# Altium schematic sheet A1-A1 Gain control driver.SchDoc: A1-A1 Gain contol driver
size D; Date: 09-24-10; DrawnBy: C. Lewis; Engineer: C. Lewis; Address1: 4650 NORRIS CANYON RD.; Address2: SAN RAMON, CA 94583; DocumentNumber: 35133; Revision: D; SheetNumber: 5; SheetTotal: 20; PageSetup: Record=PageOptions|CenterHorizontal=True|CenterVertical=True|PrintScale=0.51|XCorrection=1.00|YCorrection=1.00|PrintKind=1|BorderSize=5000000|LeftOffset=0|BottomOffset=0|Orientation=2|PaperLength=1000|PaperWidth=1000|Scale=100|PaperSource=15|PrintQuality=600|MediaType=1|DitherType=10|PaperKind=11x17|PrintScaleMode=1; DocumentName: Sheet1.SCHDOC; ModifiedDate: 10-27-11
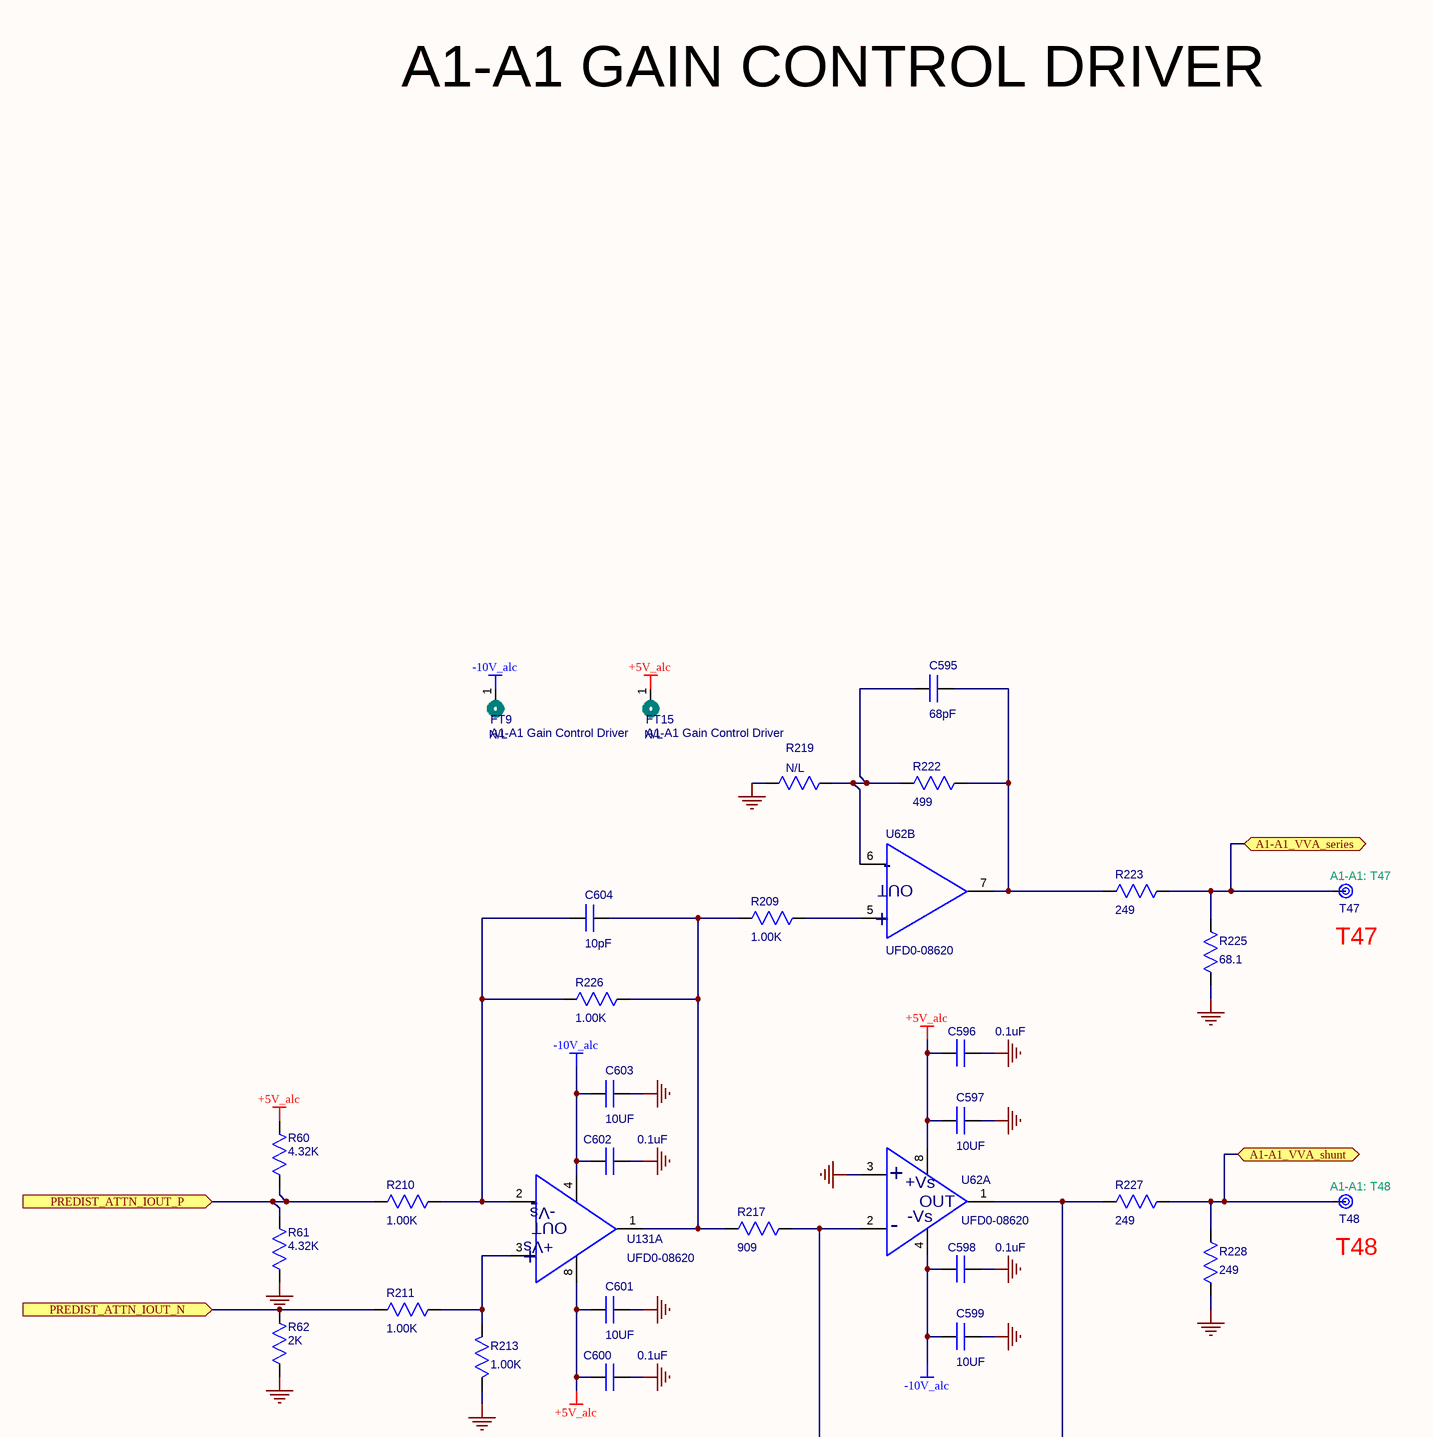
[diagram p0: A1-A1 Gain control driver.SchDoc, top right]
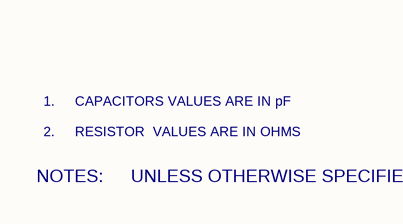
[diagram p1: A1-A1 Gain control driver.SchDoc, bottom left]
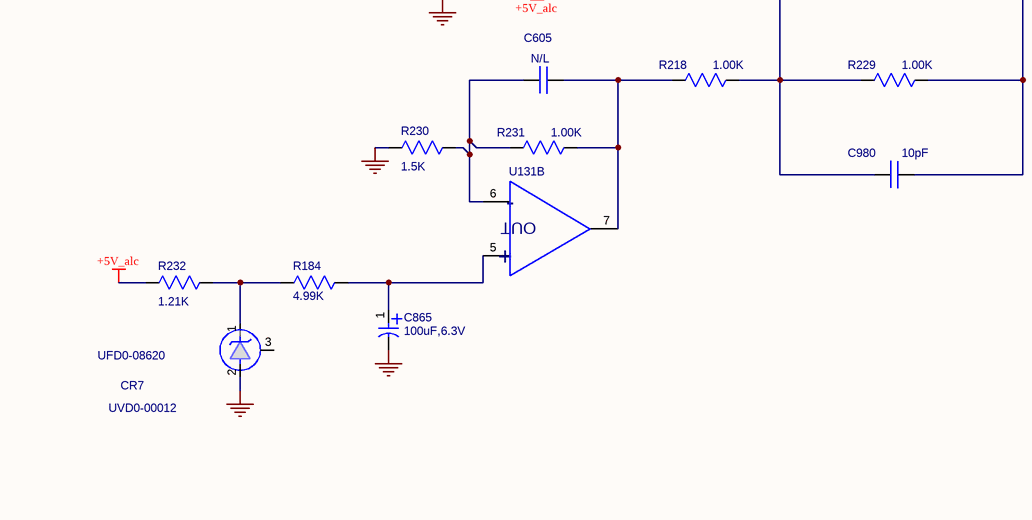
[diagram p2: A1-A1 Gain control driver.SchDoc, bottom right]

## Parts
C595  value 68pF  [CAP-0402-N]  (hidden comment: 68pF;5%;COG;50V;CHIP;0402)
C596  value 0.1uF  [CAP-0603-H035-N]  (hidden comment: .1UF;10%;X7R;16V;CHIP;0603)
C597  10UF  [CAP-1210-N]
C598  value 0.1uF  [CAP-0603-H035-N]  (hidden comment: .1UF;10%;X7R;16V;CHIP;0603)
C599  10UF  [CAP-1210-N]
C600  value 0.1uF  [CAP-0603-H035-N]  (hidden comment: .1UF;10%;X7R;16V;CHIP;0603)
C601  10UF  [CAP-1210-N]
C602  value 0.1uF  [CAP-0603-H035-N]  (hidden comment: .1UF;10%;X7R;16V;CHIP;0603)
C603  10UF  [CAP-1210-N]
C604  value 10pF  [CAP-0402-N]  (hidden comment: 10 PF;5%;COG;>50V;CHIP;0402)
C605  NoLoad: N/L  [CAP-0402-N]  (hidden comment: 2.2pF;5%;COG;50V;CHIP;0402)
C865  value 100uF,6.3V  [CAPP-3528-21-N]  (hidden comment: 100UF;20%;6.3V;.04 ESR;POLY TANT;3528)
C980  value 10pF  [CAP-0402-N]  (hidden comment: 10 PF;5%;COG;>50V;CHIP;0402)
CR7  VREF;1.235V;+/-4MV;.2MV 0-70 DEG C;SOT-23  [SOT23-N]  (value not drawn)
FT9  A1-A1 Gain Control Driver  NoLoad: N/L  [FromToNode_ML2]  (net tie, no BOM)
FT15  A1-A1 Gain Control Driver  NoLoad: N/L  [FromToNode_ML2]  (net tie, no BOM)
R60  value 4.32K  [RES-0201-N]  (hidden comment: 4.32 OHMS;.05W;1%;100PPM;FILM CHIP;0201)
R61  value 4.32K  [RES-0201-N]  (hidden comment: 4.32 OHMS;.05W;1%;100PPM;FILM CHIP;0201)
R62  value 2K  [RES-0201-N]  (hidden comment: 2 KOHMS;.05W;1%;100PPM;FILM CHIP;0201)
R184  value 4.99K  [RES-0402-N]  (hidden comment: 4.99K OHMS;.06W;1%;200PPM;FILM;CHIP;0402)
R209  value 1.00K  [RES-0402-N]  (hidden comment: 1.0K OHMS;.06W;1%;200PPM;FILM;CHIP;0402)
R210  value 1.00K  [RES-0402-N]  (hidden comment: 1.0K OHMS;.06W;1%;200PPM;FILM;CHIP;0402)
R211  value 1.00K  [RES-0402-N]  (hidden comment: 1.0K OHMS;.06W;1%;200PPM;FILM;CHIP;0402)
R213  value 1.00K  [RES-0402-N]  (hidden comment: 1.0K OHMS;.06W;1%;200PPM;FILM;CHIP;0402)
R217  value 909  [RES-0402-N]  (hidden comment: 909 OHMS; 1%; .1W; 100PPM; FILM; CHIP; 0402)
R218  value 1.00K  [RES-0402-N]  (hidden comment: 1.0K OHMS;.06W;1%;200PPM;FILM;CHIP;0402)
R219  NoLoad: N/L  [RES-0402-N]  (hidden comment: 32.4K OHMS;.06W;1%;200PPM;FILM;CHIP;0402)
R222  value 499  [RES-0402-N]  (hidden comment: 499 OHMS; 1%; .1W; 100PPM; FILM; CHIP; 0402)
R223  value 249  [RES-0402-N]  (hidden comment: 249 OHMS; 1%; .1W; 100PPM; FILM; CHIP; 0402)
R225  value 68.1  [RES-0402-N]  (hidden comment: 68.1 OHMS;.06W;1%;200PPM;FILM;CHIP;0402)
R226  value 1.00K  [RES-0402-N]  (hidden comment: 1.0K OHMS;.06W;1%;200PPM;FILM;CHIP;0402)
R227  value 249  [RES-0402-N]  (hidden comment: 249 OHMS; 1%; .1W; 100PPM; FILM; CHIP; 0402)
R228  value 249  [RES-0402-N]  (hidden comment: 249 OHMS; 1%; .1W; 100PPM; FILM; CHIP; 0402)
R229  value 1.00K  [RES-0402-N]  (hidden comment: 1.0K OHMS;.06W;1%;200PPM;FILM;CHIP;0402)
R230  value 1.5K  [RES-0402-N]  (hidden comment: 1.50K Ohms;.06W;1%;±100PPM;CHIP RES;0402)
R231  value 1.00K  [RES-0402-N]  (hidden comment: 1.0K OHMS;.06W;1%;200PPM;FILM;CHIP;0402)
R232  value 1.21K  [RES-0402-N]  (hidden comment: 1.21K OHMS;.06W;1%;200PPM;FILM;CHIP;0402)
T47  A1-A1: T47  [JIB0-11254]
T48  A1-A1: T48  [JIB0-11254]
U62  OP-AMP;DUAL:PRECISION;LOW CURRENT;LOW NOISE;WIDE  [SO8_MS-012]  (value not drawn)  (parts A,B of 2)
U131  OP-AMP;DUAL:PRECISION;LOW CURRENT;LOW NOISE;WIDE  [SO8_MS-012]  (value not drawn)  (parts A,B of 2)

## Ports
A1-A1_VVA_series, A1-A1_VVA_shunt, PREDIST_ATTN_IOUT_N, PREDIST_ATTN_IOUT_P

## Nets
+5V_alc: C596.1 C597.1 C600.1 C601.1 FT15.1 R60.2 R232.1 U62.8(V+) U131.8(V+)
-10V_alc: C598.1 C599.1 C602.1 C603.1 FT9.1 U62.4(V-) U131.4(V-)
GND: C596.2 C597.2 C598.2 C599.2 C600.2 C601.2 C602.2 C603.2 C865.2(NEG) CR7.2 R61.1 R62.1 R213.2 R219.1 R225.1 R228.1 R230.1 U62.3(+IN)
A1-A1_VVA_series: R223.2 R225.2 T47.1 ; port A1-A1_VVA_series
A1-A1_VVA_shunt: R227.2 R228.2 T48.1 ; port A1-A1_VVA_shunt
PREDIST_ATTN_IOUT_N: R62.2 R211.1 ; port PREDIST_ATTN_IOUT_N
PREDIST_ATTN_IOUT_P: R60.1 R61.2 R210.1 ; port PREDIST_ATTN_IOUT_P
NetC595_1: C595.1 R219.2 R222.1 U62.6(-IN)
NetC595_2: C595.2 R222.2 R223.1 U62.7(OUT)
NetC604_1: C604.1 R210.2 R226.1 U131.2(-IN)
NetC604_2: C604.2 R209.1 R217.1 R226.2 U131.1(OUT)
NetC605_1: C605.1 R230.2 R231.1 U131.6(-IN)
NetC605_2: C605.2 R218.1 R231.2 U131.7(OUT)
NetC865_1: C865.1(POS) R184.2 U131.5(+IN)
NetC980_1: C980.1 R217.2 R218.2 R229.1 U62.2(-IN)
NetC980_2: C980.2 R227.1 R229.2 U62.1(OUT)
NetCR7_1: CR7.1(C) R184.1 R232.2
NetR209_2: R209.2 U62.5(+IN)
NetR211_2: R211.2 R213.1 U131.3(+IN)

Not connected (* = marked no-connect by the designer): CR7 3(case)

## Notes on the sheet
- A1-A1 GAIN CONTROL DRIVER
- (near T47) T47
- (near T48) T48
- 2.     RESISTOR  VALUES ARE IN OHMS
- 1.     CAPACITORS VALUES ARE IN pF
- NOTES:
- UNLESS OTHERWISE SPECIFIED
- Title
- Sheet Title
- PRINTED DOCUMENT IS CONSIDERED UNCONTROLLED. VERIFY REVISION IN PLM SYSTEM.
- THIS DOCUMENT CONTAINS PROPRIETARY INFORMATION. DESIGN RIGHTS BELONG TO GIGA-TRONICS AND MAY NOT BE REPRODUCED WITHOUT WRITTEN AUTHORIZATION FOR ANY REASON EXCEPT CALIBRATION, OPERATION AND MAINTENANCE.
- Size
- CAGE CODE
- Filename
- D
- Document Number
- 58900
- Date
- Sheet
- Rev
- of
- (in symbol UFD0-08620, part A) -; -Vs; +Vs; +
- (in symbol UFD0-08620, part B) -; +

## Library data of the parts
C595 = CK40-00680: Approved: CL; NoLoad: .; MFGR: ANY; level: 1; line_number: 235; G_PN: CK40-00680; ModifyDate: 02/22/12; M_PN: ANY; item_number: CK40-00680
C596 C598 C600 C602 = CK45-04100: Approved: CL; NoLoad: .; MFGR: ANY; level: 1; line_number: 105; G_PN: CK45-04100; ModifyDate: 02/22/12; M_PN: ANY; item_number: CK45-04100
C597 C599 C601 C603 = CK60-06100: 10uF 10% X7R CERAMIC 16V 1210 CHIP; Approved: XiaoXiao; NoLoad: .; MFGR: ANY; level: 1; line_number: 185; ModifyDate: 10/04/2012; M_PN: ANY; G_PN: CK60-06100; Value: 10UF; item_number: CK60-06100
C604 C980 = CK40-00100: Approved: CL; NoLoad: .; MFGR: ANY; level: 1; line_number: 110; G_PN: CK40-00100; ModifyDate: 4/9/12; M_PN: ANY; item_number: CK40-00100
C605 = CK40-00022: Approved: CL; MFGR: ANY; level: 1; G_PN: CK40-00022; ModifyDate: 04/11/12; M_PN: ANY; Value: 2.2pF; item_number: CK40-00022
C865 = CT06-S7100: Approved: CL; NoLoad: .; MFGR: Kemet; M_PN: T520B107M006ATE040; level: 1; line_number: 283; G_PN: CT06-S7100; ModifyDate: 3/11/14; item_number: CT06-S7100
CR7 = UVD0-00012: M_PN: LM385M3-1.2; MFGR: TI; NoLoad: .; Approved: CL; Value: LM385M3-1.2; level: 1; line_number: 325; ModifyDate: 3/25/13; G_PN: UVD0-00012; item_number: UVD0-00012
FT9 FT15 = FromToNode: level: 1; Approved: *; G_PN: *; MFGR: *; Value: *
R60 R61 = RK30-14320: NoLoad: .; Approved: CL; MFGR: Vishay-Dale; M_PN: CRCW02014K32FKED; level: 1; line_number: 980; G_PN: RK30-14320; ModifyDate: 2/26/14; item_number: RK30-14320
R62 = RK30-12000: Approved: CL; NoLoad: .; MFGR: Vishay-Dale; M_PN: CRCW02012K00FKED; level: 1; line_number: 872; G_PN: RK30-12000; ModifyDate: 7/31/13; item_number: RK30-12000
R184 = RK35-14990: Approved: CL; NoLoad: .; MFGR: ANY; level: 1; line_number: 720; G_PN: RK35-14990; ModifyDate: 4/11/12; M_PN: ANY; item_number: RK35-14990
R209-R211 R213 R218 R226 R229 R231 = RK35-11000: Approved: CL; NoLoad: .; MFGR: ANY; level: 1; line_number: 1025; G_PN: RK35-11000; ModifyDate: 02/22/12; M_PN: ANY; item_number: RK35-11000
R217 = RK35-09090: NoLoad: .; Approved: CL; MFGR: ANY; level: 1; line_number: 1040; G_PN: RK35-09090; ModifyDate: 3/25/13; M_PN: ANY; item_number: RK35-09090
R219 = RK35-23240: Approved: CL; M_PN: ANY; level: 1; G_PN: RK35-23240; ModifyDate: 02/04/13; MFGR: ANY; Value: 32.4K; item_number: RK35-23240
R222 = RK35-04990: NoLoad: .; Approved: CL; MFGR: ANY; level: 1; line_number: 1015; G_PN: RK35-04990; ModifyDate: 02/22/12; M_PN: ANY; item_number: RK35-04990
R223 R227 R228 = RK35-02490: NoLoad: .; Approved: CL; MFGR: ANY; level: 1; line_number: 1020; G_PN: RK35-02490; ModifyDate: 02/22/12; M_PN: ANY; item_number: RK35-02490
R225 = RK35-00681: NoLoad: .; Approved: CL; MFGR: ANY; level: 1; line_number: 1030; G_PN: RK35-00681; ModifyDate: 3/26/13; M_PN: ANY; item_number: RK35-00681
R230 = RK35-11500: Approved: CL; NoLoad: .; MFGR: ANY; level: 1; line_number: 1045; G_PN: RK35-11500; ModifyDate: 4/11/12; M_PN: ANY; item_number: RK35-11500
R232 = RK35-11210: NoLoad: .; Approved: CL; MFGR: ANY; level: 1; line_number: 1050; G_PN: RK35-11210; ModifyDate: 02/22/13; M_PN: ANY; item_number: RK35-11210
T47 T48 = JIB0-11254: SOCKET;SINGLE;.018-.040 ID X .254;OPEN;GLD; NoLoad: .; MFGR: AMP; Approved: NM; M_PN: 380635; level: 1; line_number: 1065; ModifyDate: 11/30/12; G_PN: JIB0-11254; item_number: JIB0-11254
U62 U131 = UFD0-08620: Value: AD8620; NoLoad: .; Approved: CL; MFGR: ANALOG DEVICES; level: 1; line_number: 1200; ModifyDate: 02/20/13; M_PN: AD8620; G_PN: UFD0-08620; item_number: UFD0-08620